# Altium project Bessel.PrjPcb
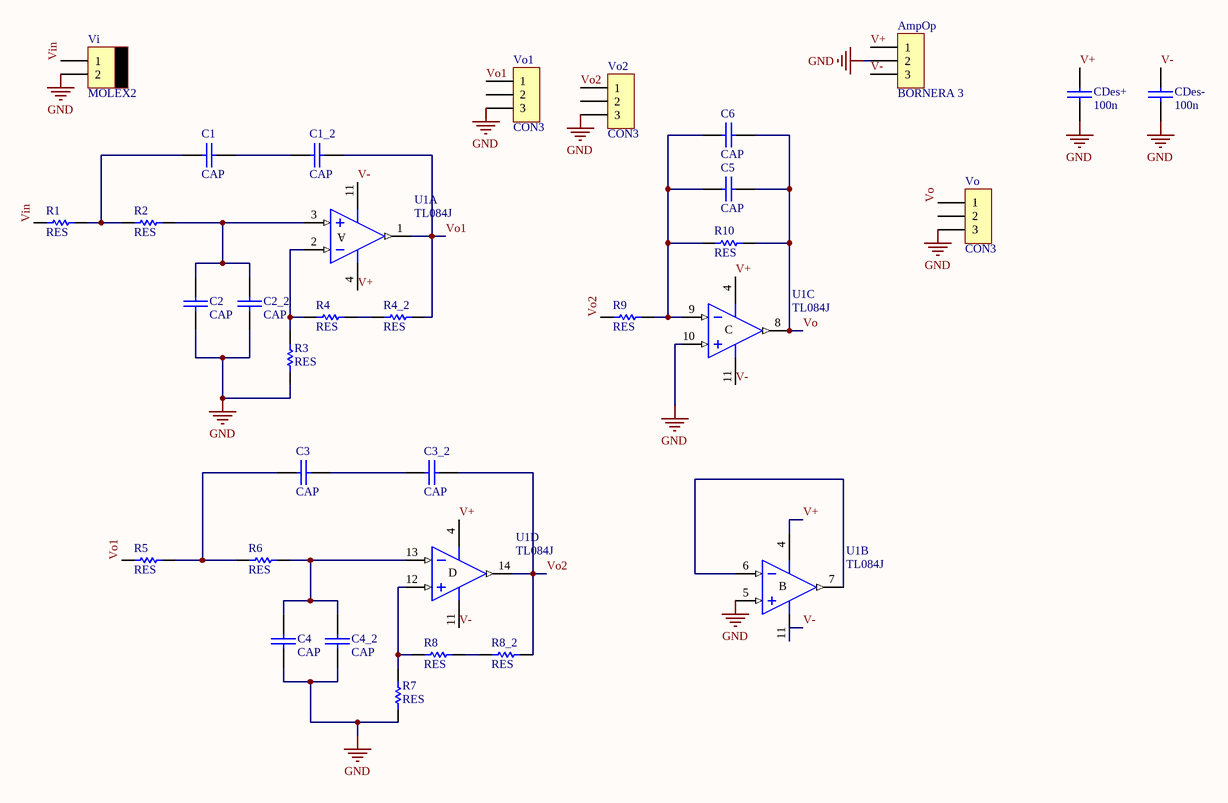
[diagram p0: Bessel.SchDoc]
1 sheet, 30 parts. Net scope: global (net labels, ports and power ports of the same name join across sheets).
Board file: Bessel2.PcbDoc

## Sheet Bessel.SchDoc
size A4

### Parts
AmpOp  BORNERA 3  [BORNERA3]
C1  CAP  [CAP200]
C1_2  CAP  [CAP200]
C2  CAP  [CAP200]
C2_2  CAP  [CAP200]
C3  CAP  [CAP200]
C3_2  CAP  [0805]
C4  CAP  [CAP200]
C4_2  CAP  [CAP200]
C5  CAP  [CAP200]
C6  CAP  [CAP200]
CDes+  100n  [CAP200]
CDes-  100n  [CAP200]
R1  RES  [RES400]
R2  RES  [RES400]
R3  RES  [0805]
R4  RES  [0805]
R4_2  RES  [0805]
R5  RES  [RES400]
R6  RES  [RES400]
R7  RES  [0805]
R8  RES  [0805]
R8_2  RES  [0805]
R9  RES  [RES400]
R10  RES  [RES400]
U1  TL084J  [J014]  (parts A,B,C,D of 4)
Vi  MOLEX2  [MOLEX2]
Vo  CON3  [SIP3]
Vo1  CON3  [SIP3]
Vo2  CON3  [SIP3]

### Nets
GND: AmpOp.2 C2.2 C2_2.2 C4.2 C4_2.2 CDes+.2 CDes-.2 R3.1 R7.1 U1.5(IN+) U1.10(IN+) Vi.2 Vo.3 Vo1.3 Vo2.3
V+: AmpOp.1 CDes+.1 U1.4(V+)
V-: AmpOp.3 CDes-.1 U1.11(V-)
Vin: R1.1 Vi.1
Vo: C5.2 C6.2 R10.2 U1.8(OUT) Vo.1
Vo1: C1_2.2 R4_2.1 R5.1 U1.1(OUT) Vo1.1
Vo2: C3_2.2 R8_2.2 R9.1 U1.14(OUT) Vo2.1
NetC1_1: C1.1 R1.2 R2.1
NetC1_2: C1.2 C1_2.1
NetC2_1: C2.1 C2_2.1 R2.2 U1.3(IN+)
NetC3_1: C3.1 R5.2 R6.1
NetC3_2: C3.2 C3_2.1
NetC4_1: C4.1 C4_2.1 R6.2 U1.13(IN-)
NetC5_1: C5.1 C6.1 R9.2 R10.1 U1.9(IN-)
NetR3_2: R3.2 R4.1 U1.2(IN-)
NetR4_2: R4.2 R4_2.2
NetR7_2: R7.2 R8.1 U1.12(IN+)
NetR8_2: R8.2 R8_2.1
NetU1_6: U1.6(IN-) U1.7(OUT)

Not connected (* = marked no-connect by the designer): Vo 2; Vo1 2; Vo2 2

### Notes on the sheet
- (in symbol TL084J, part A) A
- (in symbol TL084J, part B) B
- (in symbol TL084J, part C) C
- (in symbol TL084J, part D) D

### Library data of the parts
CDes+ CDes- = CAP
U1 = TL084J: JFET-Input Operational Amplifier; Published: 16-Jan-2001; LatestRevisionDate: 04-Mar-2005; LatestRevisionNote: Stylized 3D Model Added.; DatasheetVersion: Feb-1999; PackageReference: J014; Publisher: Altium Limited; PackageDescription: DIP; 14 Leads; Row Spacing 7.62 mm; Pitch 2.54 mm; ComponentLink1Description: Manufacturer Link; ComponentLink1URL: http://www.ti.com/; PackageVersion: Jun-1999; ComponentLink2Description: Datasheet; ComponentLink2URL: http://www-s.ti.com/sc/ds/tl084.pdf